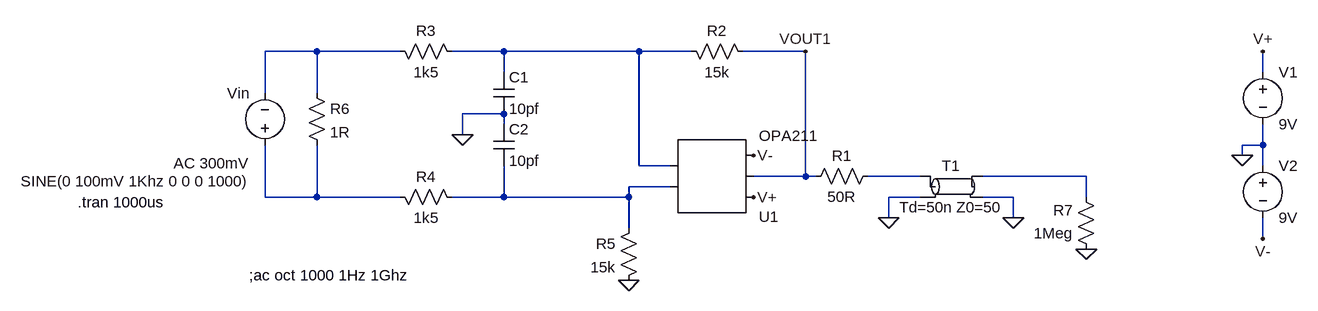
[diagram p0: schematic NE-CurrentSenseV3-LTSpiceSim.asc]
NE-CurrentSenseV3-LTSpiceSim.asc, the LTspice schematic file:
Version 4
SHEET 1 1880 680
WIRE -96 -16 -176 -16
WIRE 32 -16 -96 -16
WIRE 192 -16 112 -16
WIRE 400 -16 192 -16
WIRE 480 -16 400 -16
WIRE 656 -16 560 -16
WIRE 192 16 192 -16
WIRE 1360 16 1360 -16
WIRE -176 48 -176 -16
WIRE -96 48 -96 -16
WIRE 192 80 128 80
WIRE 192 96 192 80
WIRE 128 112 128 80
WIRE 1360 128 1360 96
WIRE 1360 128 1328 128
WIRE 1328 144 1328 128
WIRE 400 160 400 -16
WIRE 448 160 400 160
WIRE 1360 160 1360 128
WIRE 656 176 656 -16
WIRE 656 176 576 176
WIRE 672 176 656 176
WIRE 832 176 752 176
WIRE 1088 176 928 176
WIRE 448 192 384 192
WIRE -176 208 -176 128
WIRE -96 208 -96 128
WIRE -96 208 -176 208
WIRE 32 208 -96 208
WIRE 192 208 192 160
WIRE 192 208 112 208
WIRE 384 208 384 192
WIRE 384 208 192 208
WIRE 832 208 784 208
WIRE 976 208 928 208
WIRE 1088 208 1088 176
WIRE 784 240 784 208
WIRE 976 240 976 208
WIRE 384 256 384 208
WIRE 1360 272 1360 240
FLAG 1360 -16 V+
FLAG 1360 272 V-
FLAG 1328 144 0
FLAG 576 144 V-
FLAG 576 208 V+
FLAG 384 336 0
FLAG 656 -16 VOUT1
FLAG 128 112 0
FLAG 784 240 0
FLAG 976 240 0
FLAG 1088 288 0
SYMBOL voltage 1360 0 R0
WINDOW 123 0 0 Left 2
WINDOW 39 0 0 Left 2
SYMATTR InstName V1
SYMATTR Value 9V
SYMBOL voltage 1360 144 R0
WINDOW 123 0 0 Left 2
WINDOW 39 0 0 Left 2
SYMATTR InstName V2
SYMATTR Value 9V
SYMBOL res 464 -32 M90
WINDOW 0 0 56 VBottom 2
WINDOW 3 32 56 VTop 2
SYMATTR InstName R2
SYMATTR Value 15k
SYMBOL res 16 -32 M90
WINDOW 0 0 56 VBottom 2
WINDOW 3 32 56 VTop 2
SYMATTR InstName R3
SYMATTR Value 1k5
SYMBOL res 16 192 M90
WINDOW 0 0 56 VBottom 2
WINDOW 3 32 56 VTop 2
SYMATTR InstName R4
SYMATTR Value 1k5
SYMBOL res 400 240 M0
SYMATTR InstName R5
SYMATTR Value 15k
SYMBOL voltage -176 144 R180
WINDOW 0 24 96 Left 2
WINDOW 3 24 -40 Left 2
WINDOW 123 24 -12 Left 2
WINDOW 39 0 0 Left 2
SYMATTR InstName Vin
SYMATTR Value SINE(0 100mV 1Khz 0 0 0 1000)
SYMATTR Value2 AC 300mV
SYMBOL res -112 32 R0
SYMATTR InstName R6
SYMATTR Value 1R
SYMBOL cap 176 16 R0
SYMATTR InstName C1
SYMATTR Value 10pf
SYMBOL cap 176 96 R0
SYMATTR InstName C2
SYMATTR Value 10pf
SYMBOL AutoGenerated\\OPA211 512 176 M180
SYMATTR InstName U1
SYMBOL tline 880 192 R0
SYMATTR InstName T1
SYMBOL res 768 160 R90
WINDOW 0 0 56 VBottom 2
WINDOW 3 32 56 VTop 2
SYMATTR InstName R1
SYMATTR Value 50R
SYMBOL res 1104 304 R180
WINDOW 0 36 76 Left 2
WINDOW 3 36 40 Left 2
SYMATTR InstName R7
SYMATTR Value 1Meg
TEXT -464 216 Left 2 !.tran 1000us
TEXT -200 328 Left 2 !;ac oct 1000 1Hz 1Ghz

The netlist it stands for:
* NE-CurrentSenseV3-LTSpiceSim.asc
V1 V+ 0 9V
V2 0 V- 9V
R2 N002 VOUT1 15k
R3 N001 N002 1k5
R4 N006 N005 1k5
R5 N005 0 15k
Vin N006 N001 SINE(0 100mV 1Khz 0 0 0 1000) AC 300mV
R6 N001 N006 1R
C1 N002 0 10pf
C2 0 N005 10pf
* U1: OPA211 (symbol AutoGenerated\OPA211 not available, pins judged from their places): pin1=N005 pin2=N002 pin3=V+ pin4=VOUT1 pin5=V-
T1 N003 0 N004 0 Td=50n Z0=50
R1 N003 VOUT1 50R
R7 0 N004 1Meg
.tran 1000us
;ac oct 1000 1Hz 1Ghz
.backanno
.end